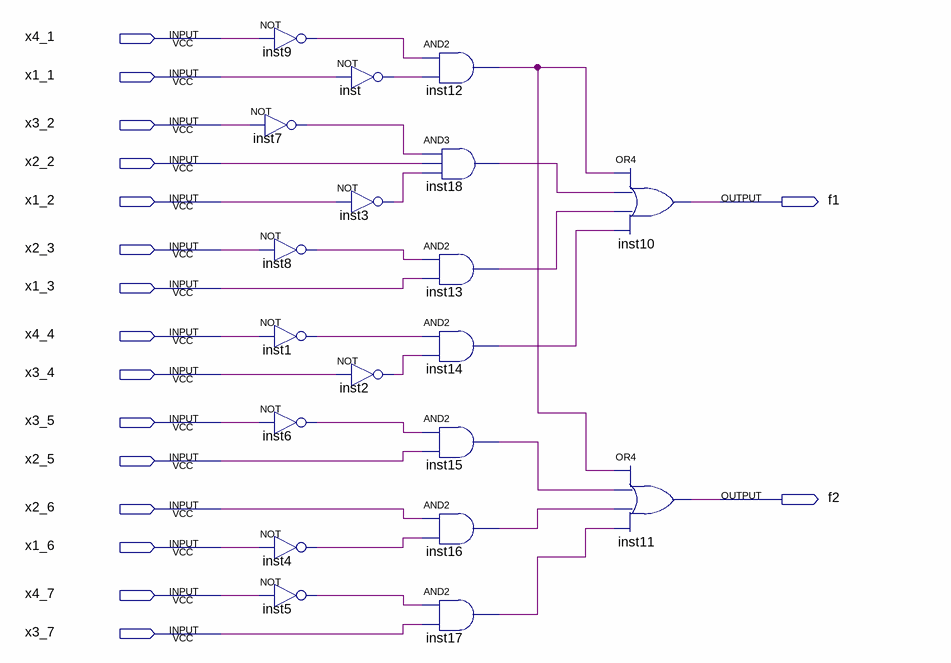
[diagram p0: schematic sheet]
// Quartus schematic DDNF K3.bdf as structural Verilog: 19 symbols, 17 pins
module \DDNF_K3  (
  input  x4_1,
  input  x1_1,
  input  x3_2,
  input  x2_2,
  input  x1_2,
  input  x2_3,
  input  x1_3,
  input  x4_4,
  input  x3_4,
  input  x3_5,
  input  x2_5,
  input  x2_6,
  input  x1_6,
  input  x4_7,
  input  x3_7,
  output f1,
  output f2
);

  wire inst1_out, inst2_out, inst3_out, inst4_out, inst5_out, inst6_out, inst7_out, inst8_out, inst9_out,
       inst12_out, inst13_out, inst14_out, inst15_out, inst16_out, inst17_out, inst18_out, inst_out;

  not inst7 (inst7_out, x3_2);
  not inst9 (inst9_out, x4_1);
  not inst8 (inst8_out, x2_3);
  not inst1 (inst1_out, x4_4);
  not inst6 (inst6_out, x3_5);
  not inst4 (inst4_out, x1_6);
  not inst5 (inst5_out, x4_7);
  not inst (inst_out, x1_1);
  not inst3 (inst3_out, x1_2);
  not inst2 (inst2_out, x3_4);
  and inst12 (inst12_out, inst9_out, inst_out);
  and inst18 (inst18_out, inst7_out, x2_2, inst3_out);
  and inst13 (inst13_out, inst8_out, x1_3);
  and inst14 (inst14_out, inst1_out, inst2_out);
  and inst15 (inst15_out, inst6_out, x2_5);
  and inst16 (inst16_out, x2_6, inst4_out);
  and inst17 (inst17_out, inst5_out, x3_7);
  or inst10 (f1, inst12_out, inst18_out, inst13_out, inst14_out);
  or inst11 (f2, inst12_out, inst15_out, inst16_out, inst17_out);
endmodule
